# EAGLE schematic SNSP-CPU-01 (EAGLE 9.6.1)
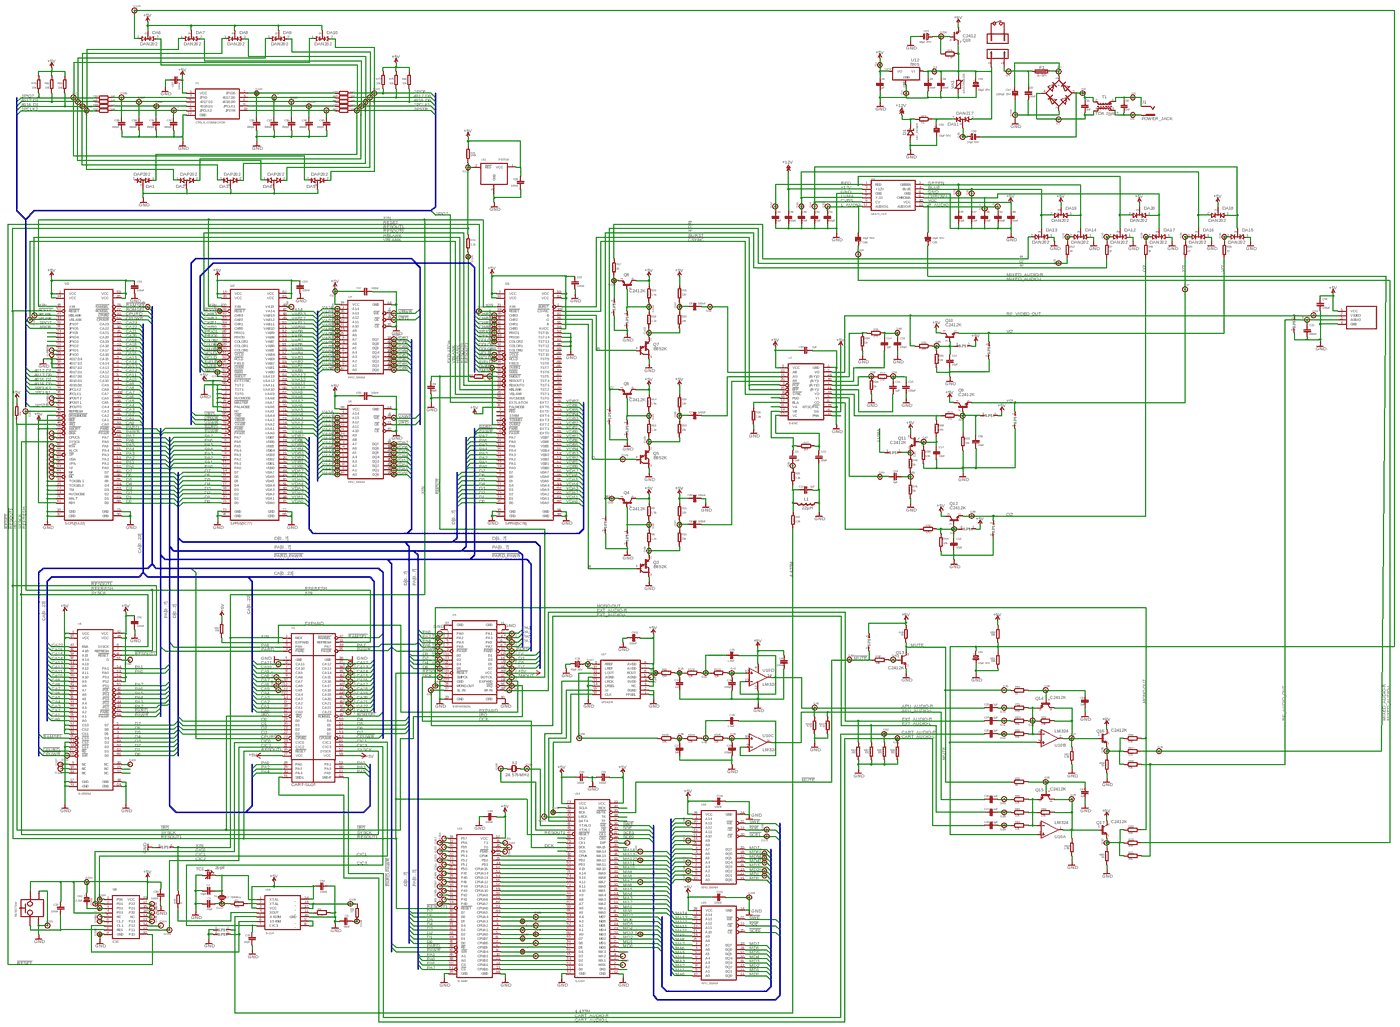
[diagram p0: schematic, sheet 1, overview]
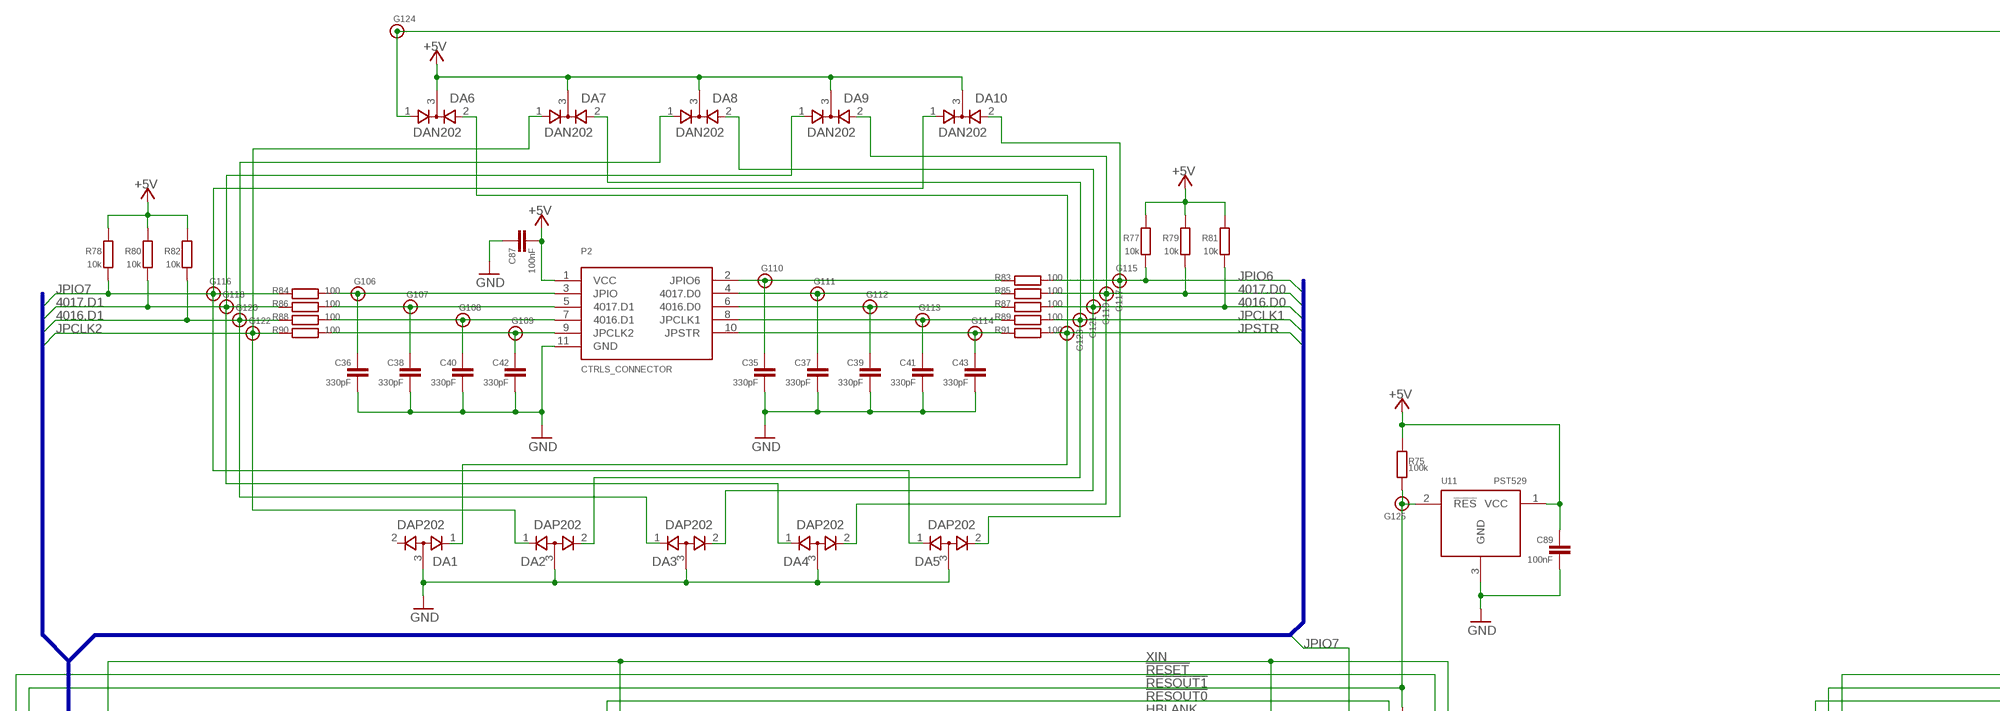
[diagram p1: schematic, sheet 1, part 1 of 4]
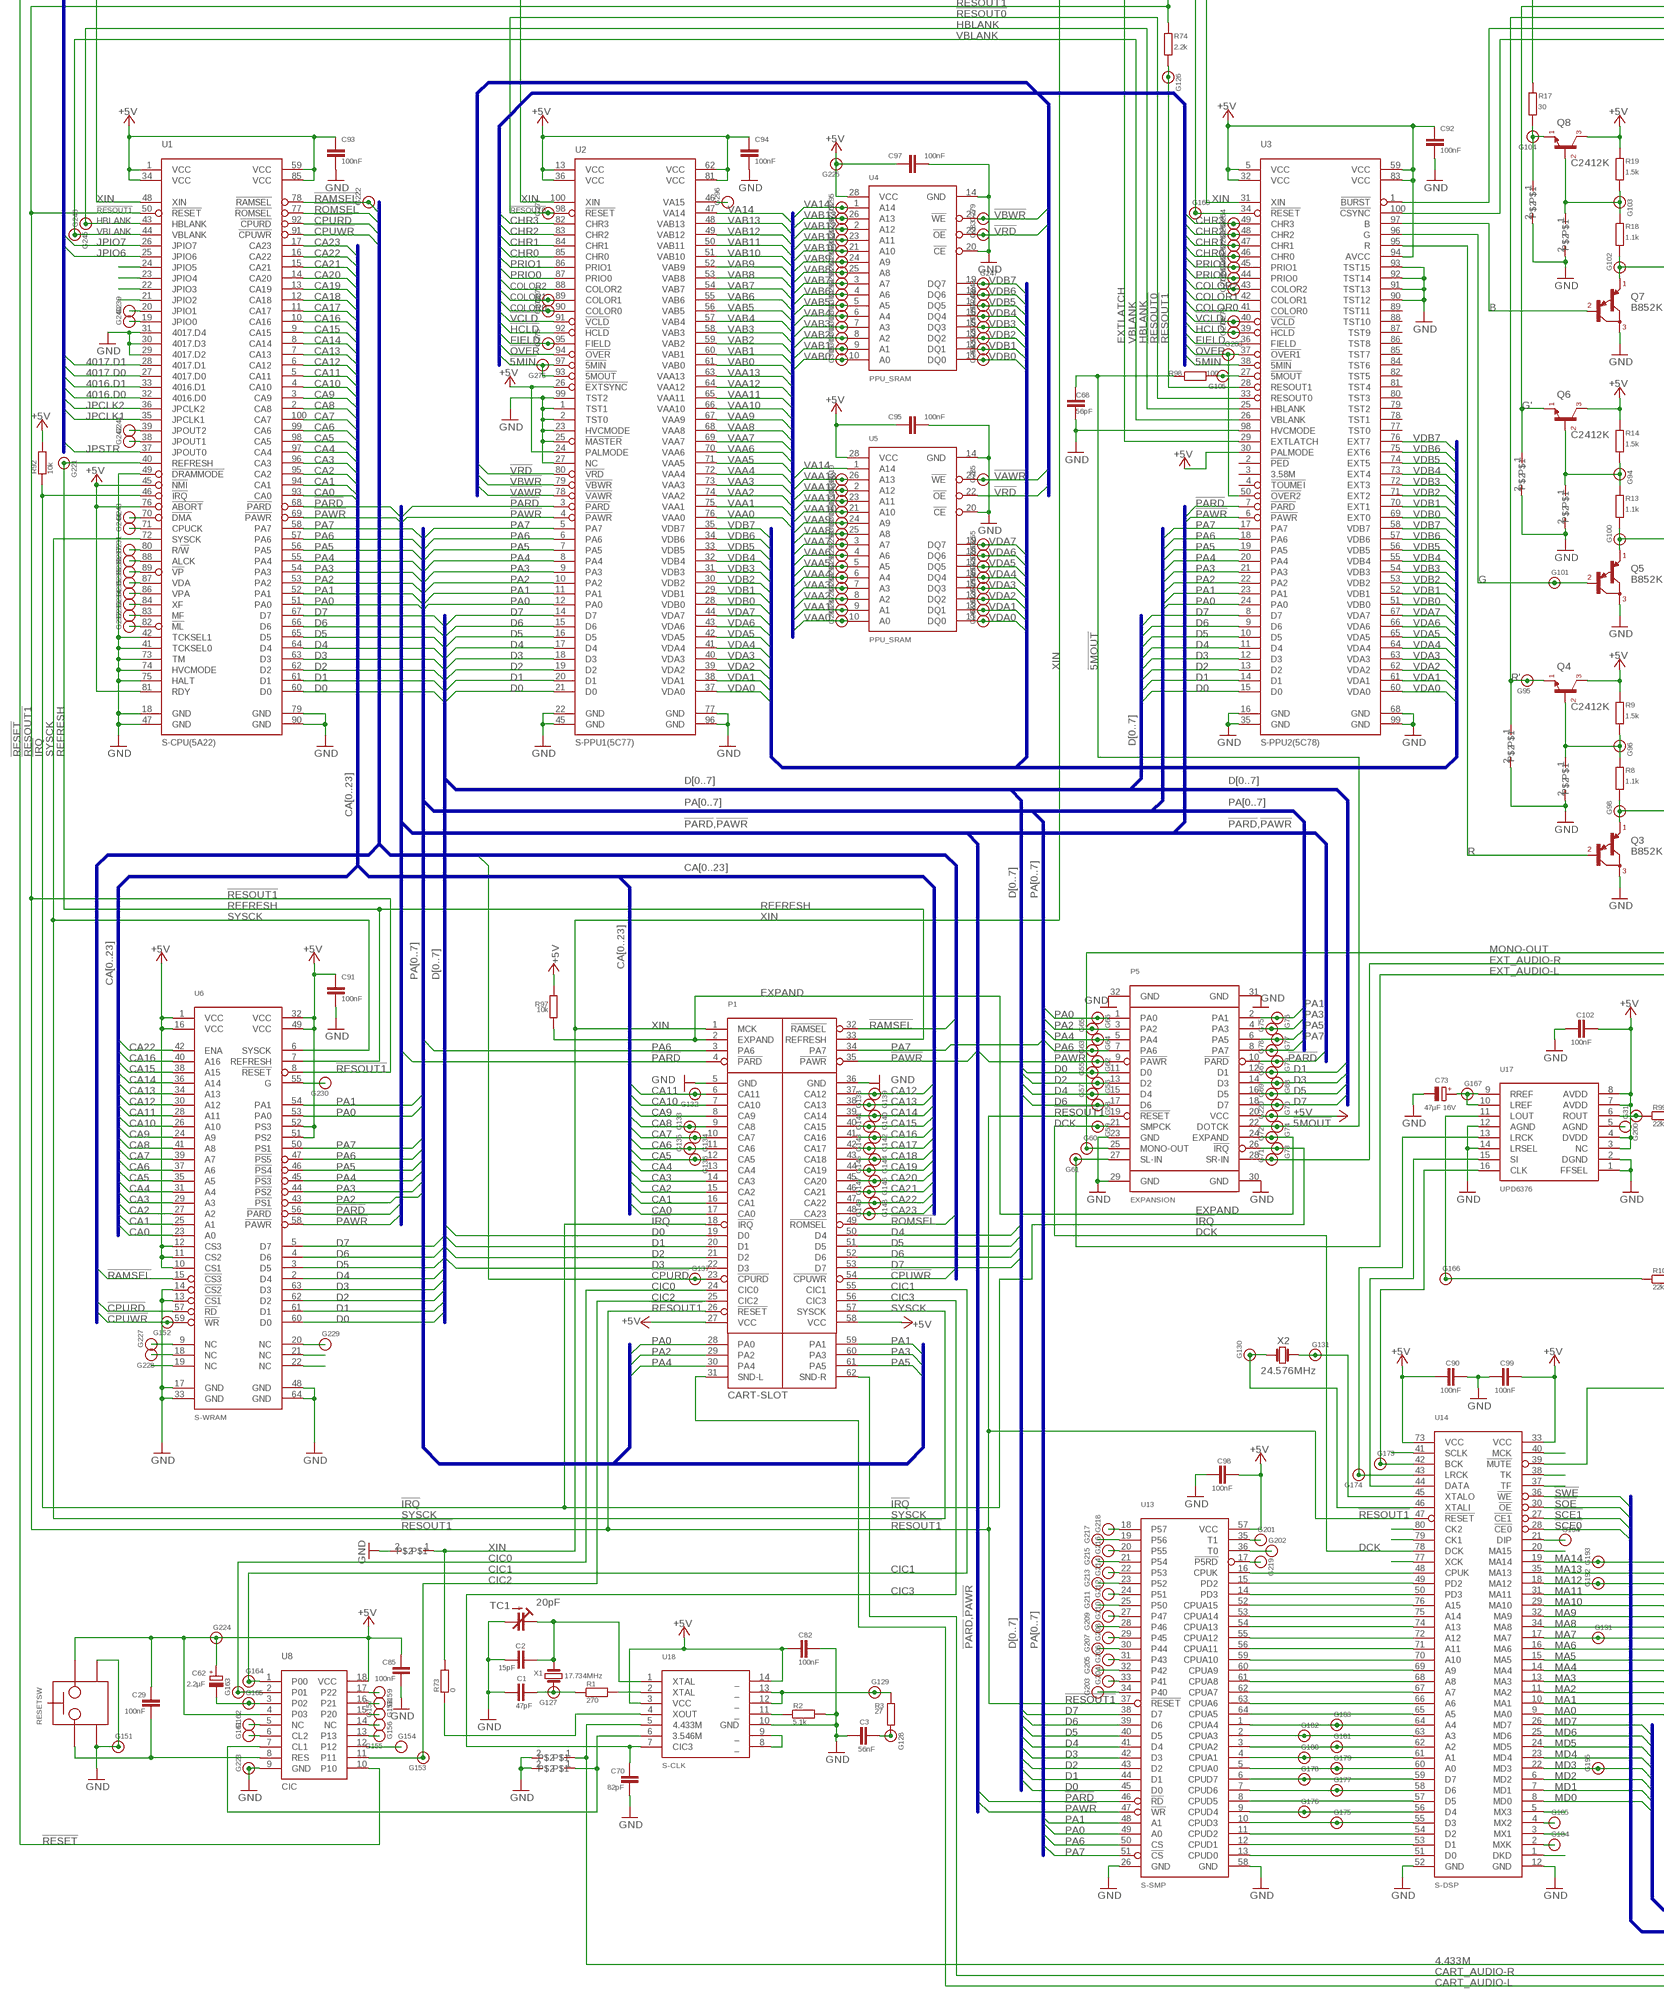
[diagram p2: schematic, sheet 1, part 2 of 4]
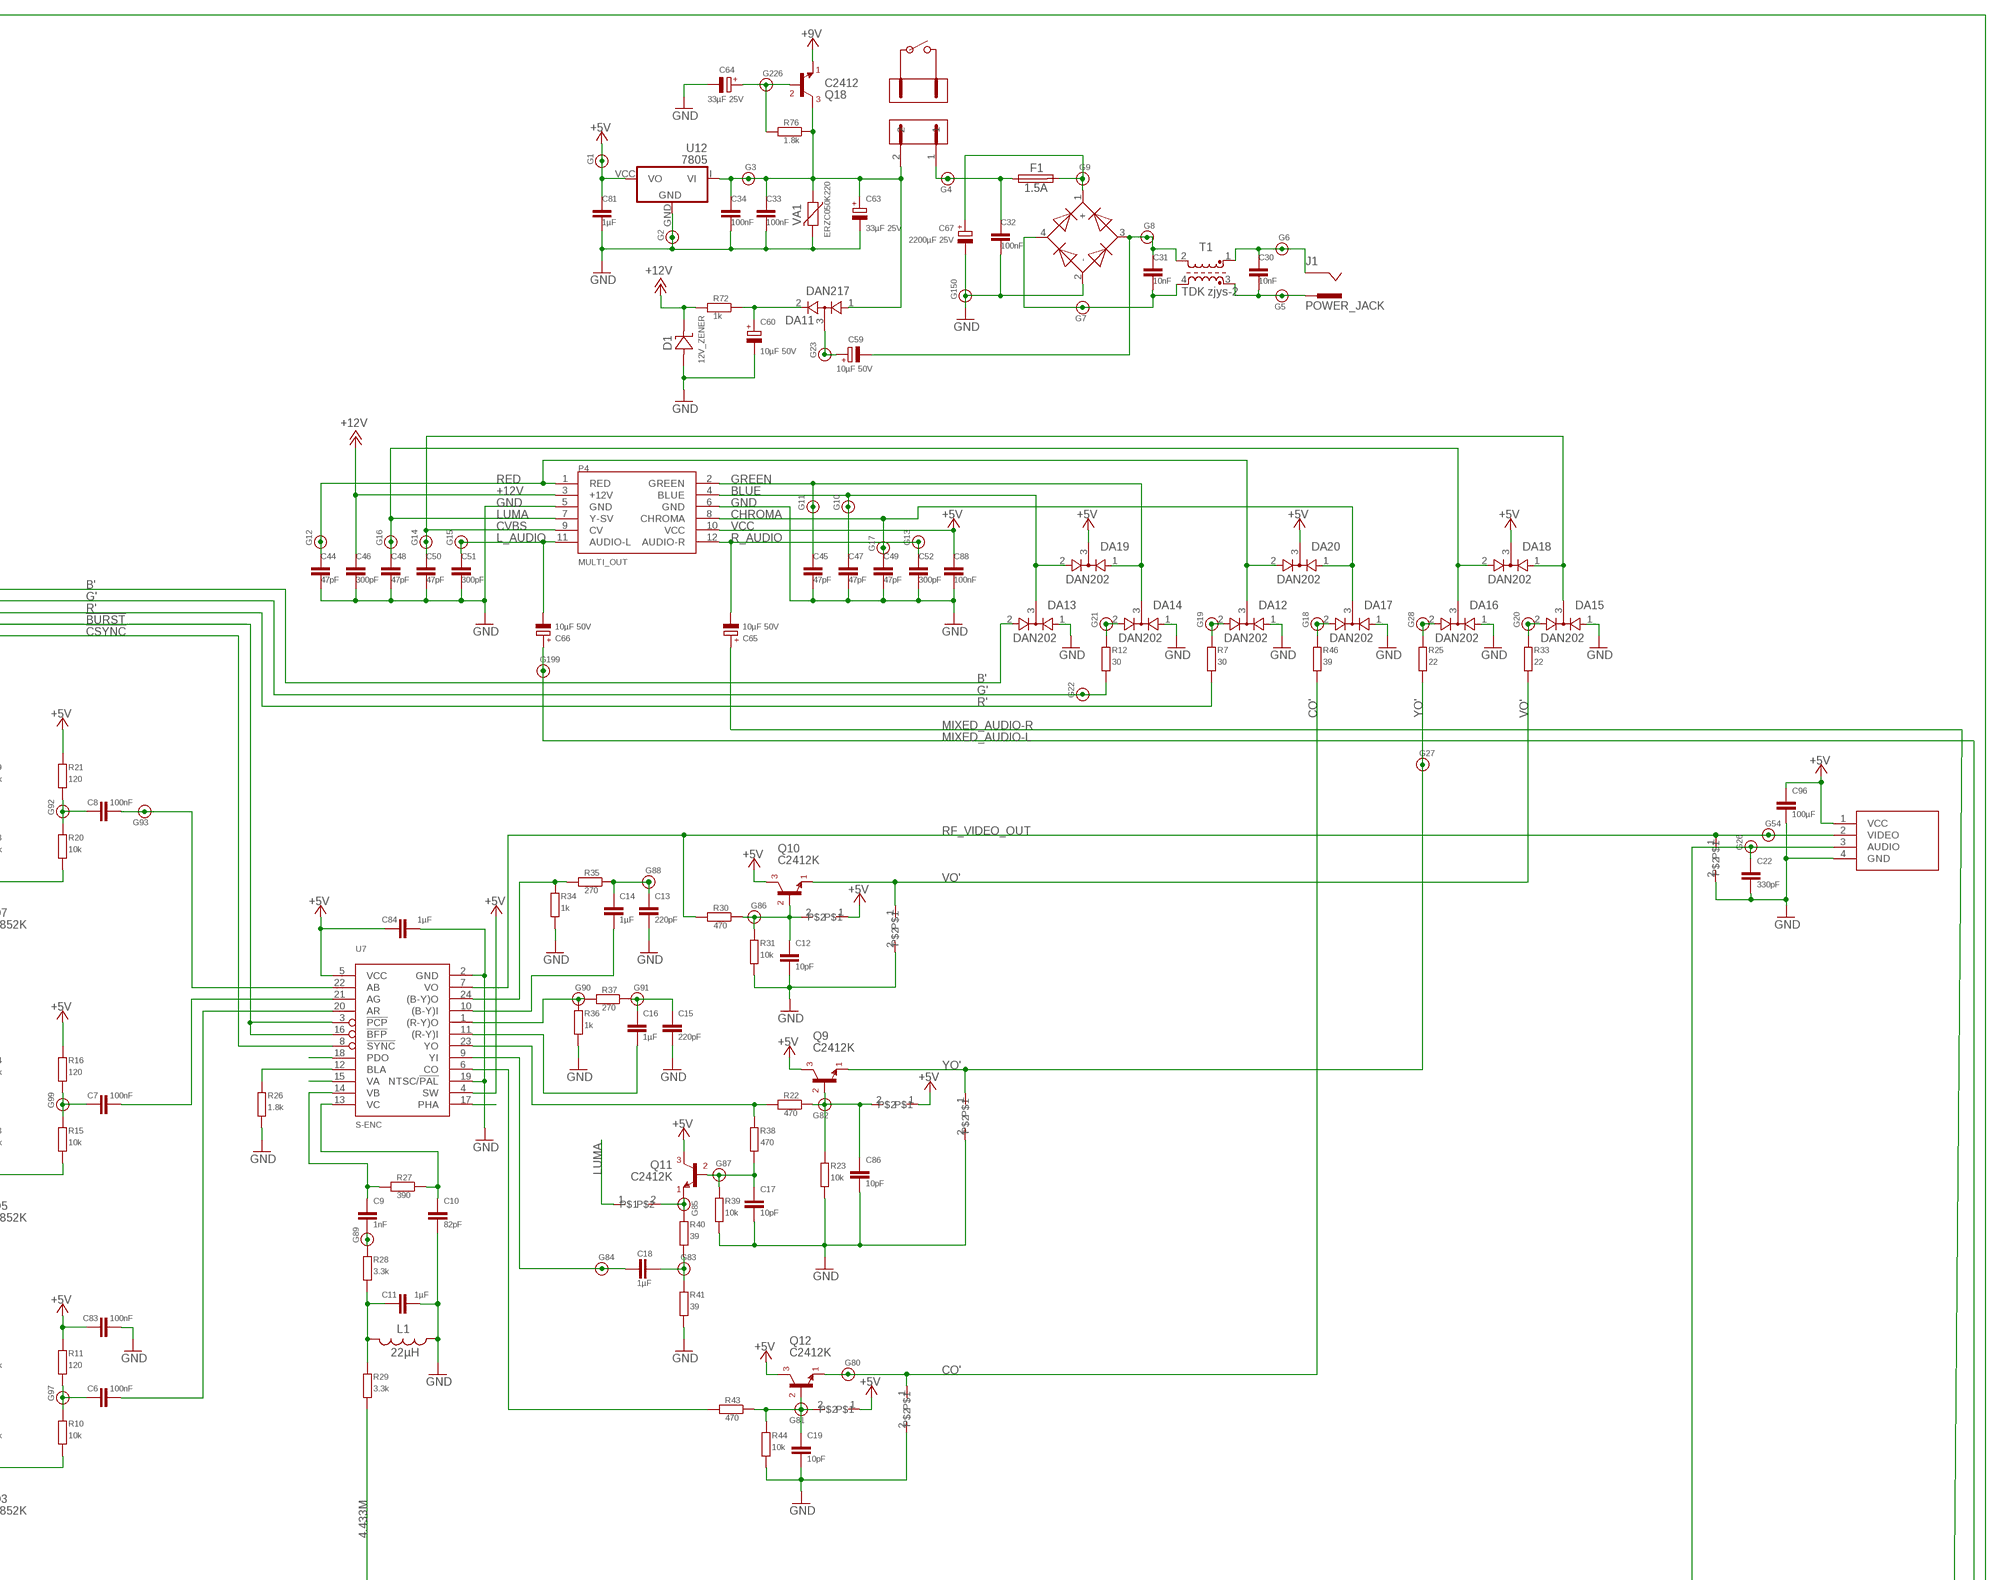
[diagram p3: schematic, sheet 1, part 3 of 4]
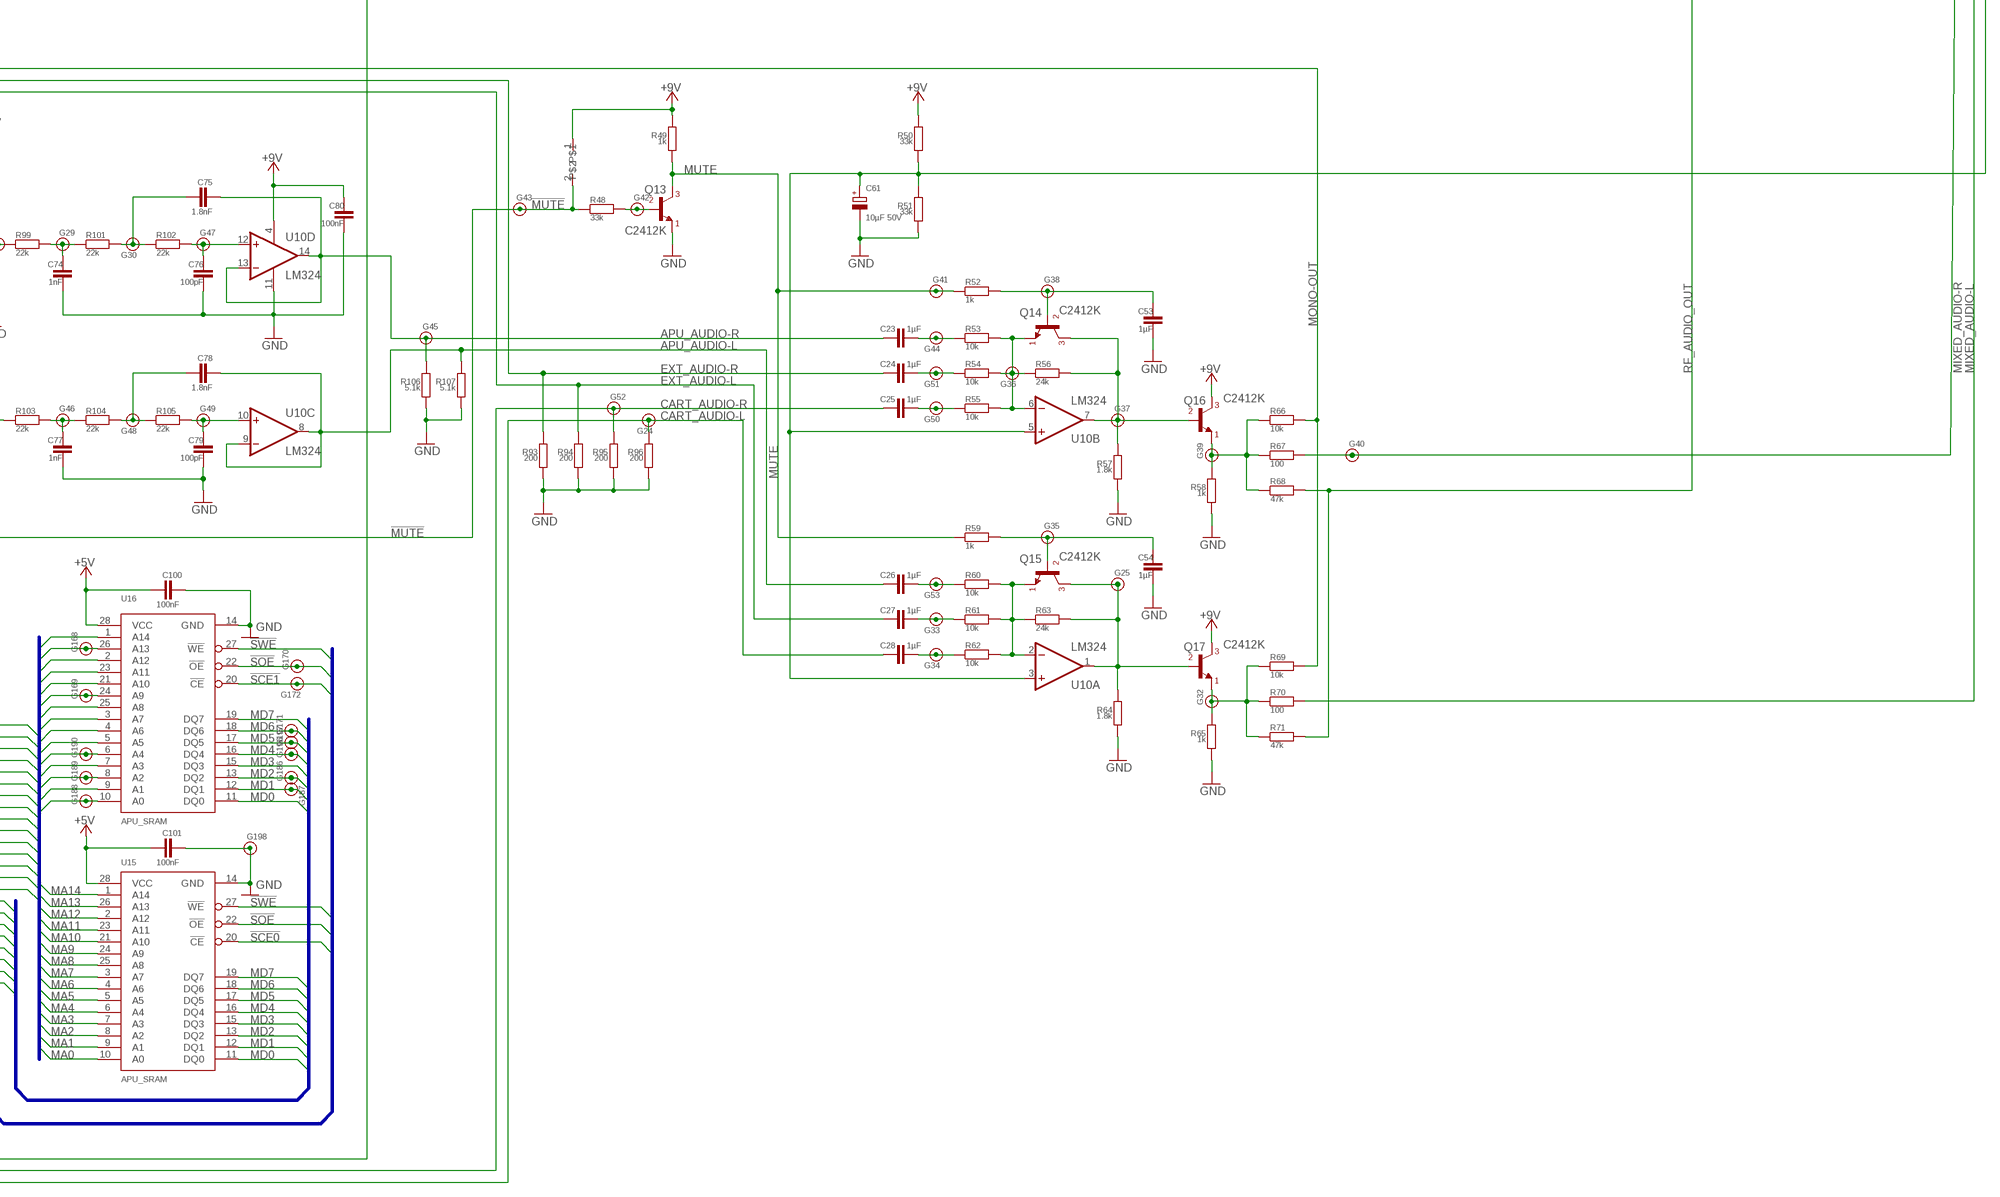
[diagram p4: schematic, sheet 1, part 4 of 4]

## Parts
C1  47pF  C0805  [0805]
C2  15pF  C0805  [0805]
C3  56nF  C0805  [0805]
C4  EMPTY_0805  [0805_EMPTY]
C5  EMPTY_0805  [0805_EMPTY]
C6  100nF  C0805  [0805]
C7  100nF  C0805  [0805]
C8  100nF  C0805  [0805]
C9  1nF  C0805  [0805]
C10  82pF  C0805  [0805]
C11  1µF  C0805  [0805]
C12  10pF  C0805  [0805]
C13  220pF  C0805  [0805]
C14  1µF  C0805  [0805]
C15  220pF  C0805  [0805]
C16  1µF  C0805  [0805]
C17  10pF  C0805  [0805]
C18  1µF  C0805  [0805]
C19  10pF  C0805  [0805]
C22  330pF  C0805  [0805]
C23  1µF  C0805  [0805]
C24  1µF  C0805  [0805]
C25  1µF  C0805  [0805]
C26  1µF  C0805  [0805]
C27  1µF  C0805  [0805]
C28  1µF  C0805  [0805]
C29  100nF  C0805  [0805]
C30  10nF  C0805  [0805]
C31  10nF  C0805  [0805]
C32  100nF  C0805  [0805]
C33  100nF  C0805  [0805]
C34  100nF  C0805  [0805]
C35  330pF  C0805  [0805]
C36  330pF  C0805  [0805]
C37  330pF  C0805  [0805]
C38  330pF  C0805  [0805]
C39  330pF  C0805  [0805]
C40  330pF  C0805  [0805]
C41  330pF  C0805  [0805]
C42  330pF  C0805  [0805]
C43  330pF  C0805  [0805]
C44  47pF  C0805  [0805]
C45  47pF  C0805  [0805]
C46  300pF  C0805  [0805]
C47  47pF  C0805  [0805]
C48  47pF  C0805  [0805]
C49  47pF  C0805  [0805]
C50  47pF  C0805  [0805]
C51  300pF  C0805  [0805]
C52  300pF  C0805  [0805]
C53  1µF  C0805  [0805]
C54  1µF  C0805  [0805]
C59  10µF 50V  CAPA_POLSMD6.5  [CAPA_POL_SMD_6.5]
C60  10µF 50V  CAPA_POLSMD6.5  [CAPA_POL_SMD_6.5]
C61  10µF 50V  CAPA_POLSMD6.5  [CAPA_POL_SMD_6.5]
C62  2.2µF  CAPA_POLSMD4.3  [CAPA_POL_SMD_4.3]
C63  33µF 25V  CAPA_POLSMD6.5  [CAPA_POL_SMD_6.5]
C64  33µF 25V  CAPA_POLSMD6.5  [CAPA_POL_SMD_6.5]
C65  10µF 50V  CAPA_POLSMD6.5  [CAPA_POL_SMD_6.5]
C66  10µF 50V  CAPA_POLSMD6.5  [CAPA_POL_SMD_6.5]
C67  2200µF 25V  CAPA_POLD16  [CAPA_POL]
C68  56pF  C0805  [0805]
C69  EMPTY_0805  [0805_EMPTY]
C70  82pF  C0805  [0805]
C73  47µF 16V  CAPA_POLSMD6.5  [CAPA_POL_SMD_6.5]
C74  1nF  C0805  [0805]
C75  1.8nF  C0805  [0805]
C76  100pF  C0805  [0805]
C77  1nF  C0805  [0805]
C78  1.8nF  C0805  [0805]
C79  100pF  C0805  [0805]
C80  100nF  C0805  [0805]
C81  1µF  C0805  [0805]
C82  100nF  C0805  [0805]
C83  100nF  C0805  [0805]
C84  1µF  C0805  [0805]
C85  100nF  C0805  [0805]
C86  10pF  C0805  [0805]
C87  100nF  C0805  [0805]
C88  100nF  C0805  [0805]
C89  100nF  C0805  [0805]
C90  100nF  C0805  [0805]
C91  100nF  C0805  [0805]
C92  100nF  C0805  [0805]
C93  100nF  C0805  [0805]
C94  100nF  C0805  [0805]
C95  100nF  C0805  [0805]
C96  100µF  C0805  [0805]
C97  100nF  C0805  [0805]
C98  100nF  C0805  [0805]
C99  100nF  C0805  [0805]
C100  100nF  C0805  [0805]
C101  100nF  C0805  [0805]
C102  100nF  C0805  [0805]
D1  12V_ZENER  D-ZENER  [SOT23]
DA1  DAP202  D_ARRAY_P202  [SOT23]
DA2  DAP202  D_ARRAY_P202  [SOT23]
DA3  DAP202  D_ARRAY_P202  [SOT23]
DA4  DAP202  D_ARRAY_P202  [SOT23]
DA5  DAP202  D_ARRAY_P202  [SOT23]
DA6  DAN202  D_ARRAY_N202  [SOT23]
DA7  DAN202  D_ARRAY_N202  [SOT23]
DA8  DAN202  D_ARRAY_N202  [SOT23]
DA9  DAN202  D_ARRAY_N202  [SOT23]
DA10  DAN202  D_ARRAY_N202  [SOT23]
DA11  DAN217  D_ARRAY_N217  [SOT23]
DA12  DAN202  D_ARRAY_N202  [SOT23]
DA13  DAN202  D_ARRAY_N202  [SOT23]
DA14  DAN202  D_ARRAY_N202  [SOT23]
DA15  DAN202  D_ARRAY_N202  [SOT23]
DA16  DAN202  D_ARRAY_N202  [SOT23]
DA17  DAN202  D_ARRAY_N202  [SOT23]
DA18  DAN202  D_ARRAY_N202  [SOT23]
DA19  DAN202  D_ARRAY_N202  [SOT23]
DA20  DAN202  D_ARRAY_N202  [SOT23]
DB1  RECTIFIER  [RECTIFIER]
E1  EMPTY_0805  [0805_EMPTY]
E2  EMPTY_0805  [0805_EMPTY]
E3  EMPTY_0805  [0805_EMPTY]
F1  1.5A  FUSE  [FUSE]
G1  TEST  [TEST]
G2  TEST  [TEST]
G3  TEST  [TEST]
G4  TEST  [TEST]
G5  TEST  [TEST]
G6  TEST  [TEST]
G7  TEST  [TEST]
G8  TEST  [TEST]
G9  TEST  [TEST]
G10  TEST  [TEST]
G11  TEST  [TEST]
G12  TEST  [TEST]
G13  TEST  [TEST]
G14  TEST  [TEST]
G15  TEST  [TEST]
G16  TEST  [TEST]
G17  TEST  [TEST]
G18  TEST  [TEST]
G19  TEST  [TEST]
G20  TEST  [TEST]
G21  TEST  [TEST]
G22  TEST  [TEST]
G23  TEST  [TEST]
G24  TEST  [TEST]
G25  TEST  [TEST]
G26  TEST  [TEST]
G27  TEST  [TEST]
G28  TEST  [TEST]
G29  TEST  [TEST]
G30  TEST  [TEST]
G31  TEST  [TEST]
G32  TEST  [TEST]
G33  TEST  [TEST]
G34  TEST  [TEST]
G35  TEST  [TEST]
G36  TEST  [TEST]
G37  TEST  [TEST]
G38  TEST  [TEST]
G39  TEST  [TEST]
G40  TEST  [TEST]
G41  TEST  [TEST]
G42  TEST  [TEST]
G43  TEST  [TEST]
G44  TEST  [TEST]
G45  TEST  [TEST]
G46  TEST  [TEST]
G47  TEST  [TEST]
G48  TEST  [TEST]
G49  TEST  [TEST]
G50  TEST  [TEST]
G51  TEST  [TEST]
G52  TEST  [TEST]
G53  TEST  [TEST]
G54  TEST  [TEST]
G55  TEST  [TEST]
G56  TEST  [TEST]
G57  TEST  [TEST]
G58  TEST  [TEST]
G59  TEST  [TEST]
G60  TEST  [TEST]
G61  TEST  [TEST]
G62  TEST  [TEST]
G63  TEST  [TEST]
G64  TEST  [TEST]
G65  TEST  [TEST]
G66  TEST  [TEST]
G67  TEST  [TEST]
G68  TEST  [TEST]
G69  TEST  [TEST]
G70  TEST  [TEST]
G71  TEST  [TEST]
G72  TEST  [TEST]
G73  TEST  [TEST]
G74  TEST  [TEST]
G75  TEST  [TEST]
G76  TEST  [TEST]
G77  TEST  [TEST]
G78  TEST  [TEST]
G79  TEST  [TEST]
G80  TEST  [TEST]
G81  TEST  [TEST]
G82  TEST  [TEST]
G83  TEST  [TEST]
G84  TEST  [TEST]
G85  TEST  [TEST]
G86  TEST  [TEST]
G87  TEST  [TEST]
G88  TEST  [TEST]
G89  TEST  [TEST]
G90  TEST  [TEST]
G91  TEST  [TEST]
G92  TEST  [TEST]
G93  TEST  [TEST]
G94  TEST  [TEST]
G95  TEST  [TEST]
G96  TEST  [TEST]
G97  TEST  [TEST]
G98  TEST  [TEST]
G99  TEST  [TEST]
G100  TEST  [TEST]
G101  TEST  [TEST]
G102  TEST  [TEST]
G103  TEST  [TEST]
G104  TEST  [TEST]
G105  TEST  [TEST]
G106  TEST  [TEST]
G107  TEST  [TEST]
G108  TEST  [TEST]
G109  TEST  [TEST]
G110  TEST  [TEST]
G111  TEST  [TEST]
G112  TEST  [TEST]
G113  TEST  [TEST]
G114  TEST  [TEST]
G115  TEST  [TEST]
G116  TEST  [TEST]
G117  TEST  [TEST]
G118  TEST  [TEST]
G119  TEST  [TEST]
G120  TEST  [TEST]
G121  TEST  [TEST]
G122  TEST  [TEST]
G123  TEST  [TEST]
G124  TEST  [TEST]
G125  TEST  [TEST]
G126  TEST  [TEST]
G127  TEST  [TEST]
G128  TEST  [TEST]
G129  TEST  [TEST]
G130  TEST  [TEST]
G131  TEST  [TEST]
G132  TEST  [TEST]
G133  TEST  [TEST]
G134  TEST  [TEST]
G135  TEST  [TEST]
G136  TEST  [TEST]
G137  TEST  [TEST]
G138  TEST  [TEST]
G139  TEST  [TEST]
G140  TEST  [TEST]
G141  TEST  [TEST]
G142  TEST  [TEST]
G143  TEST  [TEST]
G144  TEST  [TEST]
G145  TEST  [TEST]
G146  TEST  [TEST]
G147  TEST  [TEST]
G148  TEST  [TEST]
G149  TEST  [TEST]
G150  TEST  [TEST]
G151  TEST  [TEST]
G152  TEST  [TEST]
G153  TEST  [TEST]
G154  TEST  [TEST]
G155  TEST  [TEST]
G156  TEST  [TEST]
G157  TEST  [TEST]
G158  TEST  [TEST]
G159  TEST  [TEST]
G160  TEST  [TEST]
G161  TEST  [TEST]
G162  TEST  [TEST]
G163  TEST  [TEST]
G164  TEST  [TEST]
G165  TEST  [TEST]
G166  TEST  [TEST]
G167  TEST  [TEST]
G168  TEST  [TEST]
G169  TEST  [TEST]
G170  TEST  [TEST]
G171  TEST  [TEST]
G172  TEST  [TEST]
G173  TEST  [TEST]
G174  TEST  [TEST]
G175  TEST  [TEST]
G176  TEST  [TEST]
G177  TEST  [TEST]
G178  TEST  [TEST]
G179  TEST  [TEST]
G180  TEST  [TEST]
G181  TEST  [TEST]
G182  TEST  [TEST]
G183  TEST  [TEST]
G184  TEST  [TEST]
G185  TEST  [TEST]
G186  TEST  [TEST]
G187  TEST  [TEST]
G188  TEST  [TEST]
G189  TEST  [TEST]
G190  TEST  [TEST]
G191  TEST  [TEST]
G192  TEST  [TEST]
G193  TEST  [TEST]
G194  TEST  [TEST]
G195  TEST  [TEST]
G196  TEST  [TEST]
G197  TEST  [TEST]
G198  TEST  [TEST]
G199  TEST  [TEST]
G200  TEST  [TEST]
G201  TEST  [TEST]
G202  TEST  [TEST]
G203  TEST  [TEST]
G204  TEST  [TEST]
G205  TEST  [TEST]
G206  TEST  [TEST]
G207  TEST  [TEST]
G208  TEST  [TEST]
G209  TEST  [TEST]
G210  TEST  [TEST]
G211  TEST  [TEST]
G212  TEST  [TEST]
G213  TEST  [TEST]
G214  TEST  [TEST]
G215  TEST  [TEST]
G216  TEST  [TEST]
G217  TEST  [TEST]
G218  TEST  [TEST]
G219  TEST  [TEST]
G220  TEST  [TEST]
G221  TEST  [TEST]
G222  TEST  [TEST]
G223  TEST  [TEST]
G224  TEST  [TEST]
G225  TEST  [TEST]
G226  TEST  [TEST]
G227  TEST  [TEST]
G228  TEST  [TEST]
G229  TEST  [TEST]
G230  TEST  [TEST]
G231  TEST  [TEST]
G232  TEST  [TEST]
G233  TEST  [TEST]
G234  TEST  [TEST]
G235  TEST  [TEST]
G236  TEST  [TEST]
G237  TEST  [TEST]
G238  TEST  [TEST]
G239  TEST  [TEST]
G240  TEST  [TEST]
G241  TEST  [TEST]
G242  TEST  [TEST]
G243  TEST  [TEST]
G244  TEST  [TEST]
G245  TEST  [TEST]
G246  TEST  [TEST]
G247  TEST  [TEST]
G248  TEST  [TEST]
G249  TEST  [TEST]
G250  TEST  [TEST]
G251  TEST  [TEST]
G252  TEST  [TEST]
G253  TEST  [TEST]
G254  TEST  [TEST]
G255  TEST  [TEST]
G256  TEST  [TEST]
G257  TEST  [TEST]
G258  TEST  [TEST]
G259  TEST  [TEST]
G260  TEST  [TEST]
G261  TEST  [TEST]
G262  TEST  [TEST]
G263  TEST  [TEST]
G264  TEST  [TEST]
G265  TEST  [TEST]
G266  TEST  [TEST]
G267  TEST  [TEST]
G268  TEST  [TEST]
G269  TEST  [TEST]
G270  TEST  [TEST]
G271  TEST  [TEST]
G272  TEST  [TEST]
G273  TEST  [TEST]
G274  TEST  [TEST]
G275  TEST  [TEST]
G276  TEST  [TEST]
G277  TEST  [TEST]
G278  TEST  [TEST]
G279  TEST  [TEST]
G280  TEST  [TEST]
G281  TEST  [TEST]
G282  TEST  [TEST]
G283  TEST  [TEST]
G284  TEST  [TEST]
G285  TEST  [TEST]
G286  TEST  [TEST]
G287  TEST  [TEST]
G288  TEST  [TEST]
G289  TEST  [TEST]
G290  TEST  [TEST]
G291  TEST  [TEST]
G292  TEST  [TEST]
G293  TEST  [TEST]
G294  TEST  [TEST]
G295  TEST  [TEST]
G296  TEST  [TEST]
G297  TEST  [TEST]
G298  TEST  [TEST]
G299  TEST  [TEST]
G300  TEST  [TEST]
G301  TEST  [TEST]
G302  TEST  [TEST]
G303  TEST  [TEST]
G304  TEST  [TEST]
G305  TEST  [TEST]
G306  TEST  [TEST]
G307  TEST  [TEST]
G308  TEST  [TEST]
G309  TEST  [TEST]
G310  TEST  [TEST]
J1  POWER_JACK  [POWER_JACK]
J2  RF_MODULATOR  [RF]
L1  22µH  INDUCTOR  [INDUCTOR]
P1  CART-SLOT  [CART-SLOT]
P2  CTRLS_CONNECTOR  [CTRLS_CONNECTOR]
P3  PWR_SW  [PWR_SW]
P4  MULTI_OUT  [MULTI_OUT]
P5  EXPANSION  [EXPANSION]
Q3  B852K  PNP-DAR  [SOT23]
Q4  C2412K  NPN  [SOT23]
Q5  B852K  PNP-DAR  [SOT23]
Q6  C2412K  NPN  [SOT23]
Q7  B852K  PNP-DAR  [SOT23]
Q8  C2412K  NPN  [SOT23]
Q9  C2412K  NPN  [SOT23]
Q10  C2412K  NPN  [SOT23]
Q11  C2412K  NPN  [SOT23]
Q12  C2412K  NPN  [SOT23]
Q13  C2412K  NPN  [SOT23]
Q14  C2412K  NPN  [SOT23]
Q15  C2412K  NPN  [SOT23]
Q16  C2412K  NPN  [SOT23]
Q17  C2412K  NPN  [SOT23]
Q18  C2412  NPN  [SOT23]
R1  270  R0805  [0805]
R2  5.1k  R0805  [0805]
R3  27  R0805  [0805]
R4  EMPTY_0805  [0805_EMPTY]
R5  EMPTY_0805  [0805_EMPTY]
R6  EMPTY_0805  [0805_EMPTY]
R7  30  R0805  [0805]
R8  1.1k  R0805  [0805]
R9  1.5k  R0805  [0805]
R10  10k  R0805  [0805]
R11  120  R0805  [0805]
R12  30  R0805  [0805]
R13  1.1k  R0805  [0805]
R14  1.5k  R0805  [0805]
R15  10k  R0805  [0805]
R16  120  R0805  [0805]
R17  30  R0805  [0805]
R18  1.1k  R0805  [0805]
R19  1.5k  R0805  [0805]
R20  10k  R0805  [0805]
R21  120  R0805  [0805]
R22  470  R0805  [0805]
R23  10k  R0805  [0805]
R24  EMPTY_0805  [0805_EMPTY]
R25  22  R0805  [0805]
R26  1.8k  R0805  [0805]
R27  390  R0805  [0805]
R28  3.3k  R0805  [0805]
R29  3.3k  R0805  [0805]
R30  470  R0805  [0805]
R31  10k  R0805  [0805]
R32  EMPTY_0805  [0805_EMPTY]
R33  22  R0805  [0805]
R34  1k  R0805  [0805]
R35  270  R0805  [0805]
R36  1k  R0805  [0805]
R37  270  R0805  [0805]
R38  470  R0805  [0805]
R39  10k  R0805  [0805]
R40  39  R0805  [0805]
R41  39  R0805  [0805]
R42  EMPTY_0805  [0805_EMPTY]
R43  470  R0805  [0805]
R44  10k  R0805  [0805]
R45  EMPTY_0805  [0805_EMPTY]
R46  39  R0805  [0805]
R47  EMPTY_0805  [0805_EMPTY]
R48  33k  R0805  [0805]
R49  1k  R0805  [0805]
R50  33k  R0805  [0805]
R51  33k  R0805  [0805]
R52  1k  R0805  [0805]
R53  10k  R0805  [0805]
R54  10k  R0805  [0805]
R55  10k  R0805  [0805]
R56  24k  R0805  [0805]
R57  1.8k  R0805  [0805]
R58  1k  R0805  [0805]
R59  1k  R0805  [0805]
R60  10k  R0805  [0805]
R61  10k  R0805  [0805]
R62  10k  R0805  [0805]
R63  24k  R0805  [0805]
R64  1.8k  R0805  [0805]
R65  1k  R0805  [0805]
R66  10k  R0805  [0805]
R67  100  R0805  [0805]
R68  47k  R0805  [0805]
R69  10k  R0805  [0805]
R70  100  R0805  [0805]
R71  47k  R0805  [0805]
R72  1k  R0805  [0805]
R73  0  R0805  [0805]
R74  2.2k  R0805  [0805]
R75  100k  R0805  [0805]
R76  1.8k  R0805  [0805]
R77  10k  R0805  [0805]
R78  10k  R0805  [0805]
R79  10k  R0805  [0805]
R80  10k  R0805  [0805]
R81  10k  R0805  [0805]
R82  10k  R0805  [0805]
R83  100  R0805  [0805]
R84  100  R0805  [0805]
R85  100  R0805  [0805]
R86  100  R0805  [0805]
R87  100  R0805  [0805]
R88  100  R0805  [0805]
R89  100  R0805  [0805]
R90  100  R0805  [0805]
R91  100  R0805  [0805]
R92  10k  R0805  [0805]
R93  200  R0805  [0805]
R94  200  R0805  [0805]
R95  200  R0805  [0805]
R96  200  R0805  [0805]
R97  10k  R0805  [0805]
R98  100  R0805  [0805]
R99  22k  R0805  [0805]
R101  22k  R0805  [0805]
R102  22k  R0805  [0805]
R103  22k  R0805  [0805]
R104  22k  R0805  [0805]
R105  22k  R0805  [0805]
R106  5.1k  R0805  [0805]
R107  5.1k  R0805  [0805]
R108  EMPTY_0805  [0805_EMPTY]
R109  EMPTY_0805  [0805_EMPTY]
R110  EMPTY_0805  [0805_EMPTY]
R111  EMPTY_0805  [0805_EMPTY]
RESETSW  RESET_SW  [RESET_SW]
T1  TDK zjys-2  TRANSF  [TRANSF]
TC1  20pF  C-TRIMM  [C-TRIMM]
U1  S-CPU(5A22)  [100QFP0.65]
U2  S-PPU1(5C77)  [100QFP0.65]
U3  S-PPU2(5C78)  [100QFP0.65]
U4  PPU_SRAM  [SO28L]
U5  PPU_SRAM  [SO28L]
U6  S-WRAM  [SSO64]
U7  S-ENC  [SO24]
U8  CIC  [CIC]
U10  LM324  [SO14]
U11  PST529  [PST529]
U12  7805  [TO220V]
U13  S-SMP  [64QFP1.00]
U14  S-DSP  [80QFP0.8]
U15  APU_SRAM  [SO28W]
U16  APU_SRAM  [SO28W]
U17  UPD6376  [SO16]
U18  S-CLK  [SO14L]
VA1  ERZC050K220  VARISTOR  [VARISTOR]
X1  17.734MHz  XTAL_MAIN  [XTAL_MAIN]
X2  24.576MHz  XTAL_S-DSP  [XTAL_S-DSP]

## Nets
4.433M: C69.1 R29.1 U18.5(4.433M)
4016.D0: DA3.2 DA8.2 G119.T R81.1 R87.2 U1.32(4016.D0)
4016.D1: DA3.1 DA8.1 G120.T R82.1 R88.1 U1.33(4016.D1)
4017.D0: DA4.2 DA9.2 G117.T R79.1 R85.2 U1.27(4017.D0)
4017.D1: DA4.1 DA9.1 G118.T R80.1 R86.1 U1.28(4017.D1)
!5MIN: G275.T U2.93(!5MOUT) U2.97(!5MIN) U3.38(!5MIN)
!5MOUT: C68.1 G74.T P5.22(DOTCK) R98.1
!BURST: U3.1(!BURST) U7.3(!PCP) U7.16(!BFP)
!CPURD: G137.T P1.23(!CPURD) U1.92(!CPURD) U6.57(!RD)
!CPUWR: G152.T P1.54(!CPUWR) U1.91(!CPUWR) U6.59(!WR)
!CSYNC: U3.100(!CSYNC) U7.8(!SYNC)
!HCLD: G274.T U2.92(!HCLD) U3.39(!HCLD)
!IRQ: G73.T P1.18(!IRQ) P5.26(!IRQ) R92.1 U1.46(!IRQ)
!MUTE: G43.T R47.2 R48.1 U14.39(!MUTE)
!OVER: G263.T U2.94(!OVER) U3.37(!OVER1) U3.50(!OVER2)
!PARD: G79.T P1.4(!PARD) P5.10(!PARD) U1.68(!PARD) U2.3(!PARD) U3.7(!PARD) U6.56(!PARD) U13.46(!RD)
!PAWR: G62.T P1.35(!PAWR) P5.9(!PAWR) U1.69(!PAWR) U2.4(!PAWR) U3.6(!PAWR) U6.58(!PAWR) U13.47(!WR)
!RAMSEL: G222.T P1.32(!RAMSEL) U1.78(!RAMSEL) U6.15(!CS3)
!RESET: G160.T U3.34(!RESET) U8.10
!RESOUT0: G277.T U2.98(!RESET) U3.33(RESOUT0)
!RESOUT1: G125.T P1.26(!RESET) P5.19(!RESET) R74.2 R75.1 U1.50(!RESET) U6.8(!RESET) U11.2(!RES) U13.37(!RESET) U14.47(!RESET)
!ROMSEL: P1.49(!ROMSEL) U1.77(!ROMSEL)
!SCE0: U14.28(!CE0) U15.20(!CE)
!SCE1: G172.T U14.27(!CE1) U16.20(!CE)
!SOE: G170.T U14.30(!OE) U15.22(!OE) U16.22(!OE)
!SWE: U14.36(!WE) U15.27(!WE) U16.27(!WE)
!VAWR: G285.T U2.78(!VAWR) U5.27(!WE)
!VBWR: G279.T U2.79(!VBWR) U4.27(!WE)
!VCLD: G273.T U2.91(!VCLD) U3.40(!VCLD)
!VRD: G283.T U2.80(!VRD) U4.22(!OE) U5.22(!OE)
+9V: C80.2 Q16.3 Q17.3 Q18.2 R47.1 R49.1 R50.1 U10.4(P:V+)
+12V: C46.2 D1.3 P4.3(+12V) R72.2
/RESOUT1: G126.T R74.1 U3.28(RESOUT1)
APU_AUDIO-L: C26.1 C78.2 R107.1 U10.8(C:OUT) U10.9(C:-IN)
APU_AUDIO-R: C23.1 C75.2 G45.T R106.1 U10.13(D:-IN) U10.14(D:OUT)
B: Q7.1 U3.97(B)
B': DA13.2 R17.2
BLUE: C47.2 DA13.3 DA19.2 G10.T P4.4(BLUE)
CA0: P1.17(CA0) U1.93(CA0) U6.23(A0)
CA1: P1.16(CA1) U1.94(CA1) U6.25(A1)
CA2: P1.15(CA2) U1.95(CA2) U6.27(A2)
CA3: P1.14(CA3) U1.96(CA3) U6.29(A3)
CA4: P1.13(CA4) U1.97(CA4) U6.31(A4)
CA5: G136.T P1.12(CA5) U1.98(CA5) U6.35(A5)
CA6: G135.T P1.11(CA6) U1.99(CA6) U6.37(A6)
CA7: G134.T P1.10(CA7) U1.100(CA7) U6.39(A7)
CA8: G133.T P1.9(CA8) U1.2(CA8) U6.41(A8)
CA9: P1.8(CA9) U1.3(CA9) U6.24(A9)
CA10: P1.7(CA10) U1.4(CA10) U6.26(A10)
CA11: G132.T P1.6(CA11) U1.5(CA11) U6.28(A11)
CA12: G139.T P1.37(CA12) U1.6(CA12) U6.30(A12)
CA13: G138.T P1.38(CA13) U1.7(CA13) U6.34(A13)
CA14: G140.T P1.39(CA14) U1.8(CA14) U6.36(A14)
CA15: G141.T P1.40(CA15) U1.9(CA15) U6.38(A15)
CA16: G142.T P1.41(CA16) U1.10(CA16) U6.40(A16)
CA17: G143.T P1.42(CA17) U1.11(CA17)
CA18: G144.T P1.43(CA18) U1.12(CA18)
CA19: G145.T P1.44(CA19) U1.13(CA19)
CA20: G146.T P1.45(CA20) U1.14(CA20)
CA21: G147.T P1.46(CA21) U1.15(CA21)
CA22: G148.T P1.47(CA22) U1.16(CA22) U6.42(ENA)
CA23: G149.T P1.48(CA23) U1.17(CA23)
CART_AUDIO-L: C28.1 G24.T P1.31(SND-L) R96.1
CART_AUDIO-R: C25.1 G52.T P1.62(SND-R) R95.1
CHR0: G267.T U2.85(CHR0) U3.46(CHR0)
CHR1: G266.T U2.84(CHR1) U3.47(CHR1)
CHR2: G265.T U2.83(CHR2) U3.48(CHR2)
CHR3: G264.T U2.82(CHR3) U3.49(CHR3)
CHROMA: C49.2 DA17.3 DA20.1 G17.T P4.8(CHROMA)
CIC0: G163.T P1.24(CIC0) U8.2(P01)
CIC1: G164.T P1.55(CIC1) U8.1(P00)
CIC2: G153.T P1.25(CIC2) U8.11
CIC3: C70.1 P1.56(CIC3) U18.7(CIC3)
CO': G80.T Q12.2 R45.1 R46.1
COLOR0: G272.T U2.90(COLOR0) U3.41(COLOR0)
COLOR1: G271.T U2.89(COLOR1) U3.42(COLOR1)
COLOR2: G270.T U2.88(COLOR2) U3.43(COLOR2)
CVBS: C50.2 DA15.3 DA18.1 G14.T P4.9(CV)
D0: G55.T P1.19(D0) P5.11(D0) U1.60(D0) U2.21(D0) U3.15(D0) U6.60(D0) U13.45(D0)
D1: G67.T P1.20(D1) P5.12(D1) U1.61(D1) U2.20(D1) U3.14(D1) U6.61(D1) U13.44(D1)
D2: G56.T P1.21(D2) P5.13(D2) U1.62(D2) U2.19(D2) U3.13(D2) U6.62(D2) U13.43(D2)
D3: G68.T P1.22(D3) P5.14(D3) U1.63(D3) U2.18(D3) U3.12(D3) U6.63(D3) U13.42(D3)
D4: G57.T P1.50(D4) P5.15(D4) U1.64(D4) U2.17(D4) U3.11(D4) U6.2(D4) U13.41(D4)
D5: G69.T P1.51(D5) P5.16(D5) U1.65(D5) U2.16(D5) U3.10(D5) U6.3(D5) U13.40(D5)
D6: G58.T P1.52(D6) P5.17(D6) U1.66(D6) U2.15(D6) U3.9(D6) U6.4(D6) U13.39(D6)
D7: G70.T P1.53(D7) P5.18(D7) U1.67(D7) U2.14(D7) U3.8(D7) U6.5(D7) U13.38(D7)
DCK: G59.T P5.21(SMPCK) U14.78(DCK)
EXPAND: G72.T P1.2(EXPAND) P5.24(EXPAND) R97.1
EXT_AUDIO-L: C27.1 G61.T P5.27(SL-IN) R94.1
EXT_AUDIO-R: C24.1 G71.T P5.28(SR-IN) R93.1
FIELD: G276.T U2.95(FIELD) U3.36(FIELD)
G: G101.T Q5.1 U3.96(G)
G': G22.T Q6.2 R5.1 R12.1
GND: C1.2 C2.2 C3.1 C4.2 C5.2 C10.2 C11.2 C12.2 C13.1 C15.1 C17.2 C19.2 C22.2 C32.1 C33.1 C34.1 C35.2 C36.2 C37.2 C38.2 C39.2 C40.2 C41.2 C42.2 C43.2 C44.1 C45.1 C46.1 C47.1 C48.1 C49.1 C50.1 C51.1 C52.1 C53.1 C54.1 C60.- C61.- C63.- C64.- C67.- C68.2 C69.2 C70.2 C73.- C74.1 C76.1 C77.1 C79.1 C80.1 C81.1 C82.2 C83.2 C84.2 C85.2 C86.2 C87.1 C88.1 C89.2 C90.2 C91.2 C92.2 C93.2 C94.2 C95.2 C96.2 C97.2 C98.1 C99.1 C100.2 C101.2 C102.1 D1.1 DA1.3 DA2.3 DA3.3 DA4.3 DA5.3 DA12.1 DA13.1 DA14.1 DA15.1 DA16.1 DA17.1 DB1.2(-) E1.2 E2.2 E3.2 G2.T G150.T G151.T G198.T G223.T J2.4(GND) L1.1 P1.5(GND) P1.36(GND) P2.11(GND) P4.5(GND) P4.6(GND) P5.23(GND) P5.29(GND) P5.30(GND) P5.31(GND) P5.32(GND) Q3.3 Q5.3 Q7.3 Q13.2 R2.2 R4.2 R5.2 R6.2 R23.1 R24.2 R26.1 R31.1 R32.2 R34.1 R36.1 R39.1 R41.1 R44.1 R45.2 R51.2 R57.2 R58.2 R64.2 R65.2 R93.2 R94.2 R95.2 R96.2 R106.2 R107.2 R111.2 RESETSW.3(GND) RESETSW.4(GND) TC1.- U1.18(GND) U1.29(4017.D2) U1.30(4017.D3) U1.31(4017.D4) U1.41(TCKSEL0) U1.42(TCKSEL1) U1.47(GND) U1.49(!DRAMMODE) U1.73(TM) U1.74(HVCMODE) U1.75(HALT) U1.79(GND) U1.90(GND) U2.1(TST1) U2.2(TST0) U2.22(GND) U2.23(HVCMODE) U2.25(!MASTER) U2.27(NC) U2.45(GND) U2.77(GND) U2.96(GND) U2.99(TST2) U3.16(GND) U3.35(GND) U3.68(GND) U3.90(TST12) U3.91(TST13) U3.92(TST14) U3.93(TST15) U3.98(HVCMODE) U3.99(GND) U4.14(GND) U4.20(!CE) U5.14(GND) U5.20(!CE) U6.13(!CS1) U6.14(!CS2) U6.17(GND) U6.33(GND) U6.48(GND) U6.64(GND) U7.2(GND) U7.19(NTSC/!PAL) U8.9(GND) U10.11(P:V-) U11.3(GND) U12.GND U13.26(GND) U13.58(GND) U14.12(GND) U14.52(GND) U15.14(GND) U16.14(GND) U17.1(FFSEL) U17.2(DGND) U17.12(AGND) U17.14(LRSEL) U18.10(GND) VA1.2
GREEN: C45.2 DA14.3 DA19.1 G11.T P4.2(GREEN)
HBLANK: G246.T U1.43(HBLANK) U3.25(HBLANK)
JPCLK1: DA2.2 DA7.2 G121.T R89.2 U1.35(JPCLK1)
JPCLK2: DA2.1 DA7.1 G122.T R90.1 U1.36(JPCLK2)
JPIO6: DA5.2 DA10.2 G115.T R77.1 R83.2 U1.25(JPIO6)
JPIO7: DA5.1 DA10.1 G116.T R78.1 R84.1 U1.26(JPIO7) U3.29(EXTLATCH)
JPSTR: DA1.1 DA6.2 G123.T R91.2 U1.37(JPOUT0)
L_AUDIO: C51.2 C66.- G15.T P4.11(AUDIO-L)
LUMA: C48.2 DA16.3 DA18.2 G16.T P4.7(Y-SV) R42.1
MA0: G188.T U14.9(MA0) U15.10(A0) U16.10(A0)
MA1: U14.10(MA1) U15.9(A1) U16.9(A1)
MA2: G189.T U14.11(MA2) U15.8(A2) U16.8(A2)
MA3: U14.13(MA3) U15.7(A3) U16.7(A3)
MA4: G190.T U14.14(MA4) U15.6(A4) U16.6(A4)
MA5: U14.15(MA5) U15.5(A5) U16.5(A5)
MA6: U14.16(MA6) U15.4(A6) U16.4(A6)
MA7: G191.T U14.17(MA7) U15.3(A7) U16.3(A7)
MA8: U14.34(MA8) U15.25(A8) U16.25(A8)
MA9: G169.T U14.32(MA9) U15.24(A9) U16.24(A9)
MA10: U14.29(MA10) U15.21(A10) U16.21(A10)
MA11: U14.31(MA11) U15.23(A11) U16.23(A11)
MA12: G192.T U14.18(MA12) U15.2(A12) U16.2(A12)
MA13: G168.T U14.35(MA13) U15.26(A13) U16.26(A13)
MA14: G193.T U14.19(MA14) U15.1(A14) U16.1(A14)
MA15: U14.20(MA15)
MD0: U14.8(MD0) U15.11(DQ0) U16.11(DQ0)
MD1: G187.T U14.7(MD1) U15.12(DQ1) U16.12(DQ1)
MD2: G186.T U14.6(MD2) U15.13(DQ2) U16.13(DQ2)
MD3: G195.T U14.22(MD3) U15.15(DQ3) U16.15(DQ3)
MD4: G196.T U14.23(MD4) U15.16(DQ4) U16.16(DQ4)
MD5: G197.T U14.24(MD5) U15.17(DQ5) U16.17(DQ5)
MD6: G171.T U14.25(MD6) U15.18(DQ6) U16.18(DQ6)
MD7: U14.26(MD7) U15.19(DQ7) U16.19(DQ7)
MIXED_AUDIO-L: C66.+ G199.T R70.2
MIXED_AUDIO-R: C65.+ G40.T R67.2
MONO-OUT: G60.T P5.25(MONO-OUT) R66.2 R69.2
MUTE: G41.T Q13.3 R49.2 R52.1 R59.1
N$1: C4.1 U8.7(CL1) U18.6(3.546M)
N$2: R1.2 U18.2(XTAL)
N$3: C62.- G165.T U8.3(P02)
N$4: C29.2 RESETSW.2 U8.8(RES)
N$5: R73.1 U18.4(XOUT)
N$6: C36.1 G106.T P2.3(JPIO) R84.2
N$7: C1.1 G127.T R1.1 X1.P$1
N$8: C38.1 G107.T P2.5(4017.D1) R86.2
N$9: R2.1 U18.11(_)
N$10: C2.1 TC1.+ U18.1(XTAL) X1.P$2
N$11: G129.T R3.1 U18.12(_) U18.13(_)
N$12: C40.1 G108.T P2.7(4016.D1) R88.2
N$13: U18.8(_) U18.9(_)
N$14: C42.1 G109.T P2.9(JPCLK2) R90.2
N$15: C35.1 G110.T P2.2(JPIO6) R83.1
N$16: C37.1 G111.T P2.4(4017.D0) R85.1
N$17: C39.1 G112.T P2.6(4016.D0) R87.1
N$18: C41.1 G113.T P2.8(JPCLK1) R89.1
N$19: C43.1 G114.T P2.10(JPSTR) R91.1
N$20: C61.+ DA6.1 G124.T R50.2 R51.1 U10.3(A:+IN) U10.5(B:+IN)
N$21: G105.T R98.2 U3.27(!5MOUT)
N$22: E1.1 G96.T Q4.1 R8.2 R9.1
N$23: C6.1 G97.T R10.2 R11.1
N$24: G98.T Q3.2 R8.1 R10.1
N$25: E2.1 G94.T Q6.1 R13.2 R14.1
N$26: C6.2 U7.20(AR)
N$27: C7.1 G99.T R15.2 R16.1
N$28: G100.T Q5.2 R13.1 R15.1
N$29: C7.2 U7.21(AG)
N$30: E3.1 G103.T Q8.1 R18.2 R19.1
N$31: C8.1 G92.T R20.2 R21.1
N$32: G102.T Q7.2 R18.1 R20.1
N$33: C8.2 G93.T U7.22(AB)
N$34: G104.T Q8.2 R6.1 R17.1
N$35: R26.2 U7.12(BLA)
N$36: R34.2 R35.2 U7.24((B-Y)O)
N$37: C13.2 C14.2 G88.T R35.1
N$38: G90.T R36.2 R37.2 U7.1((R-Y)O)
N$39: C15.2 C16.2 G91.T R37.1
N$40: C19.1 G81.T Q12.1 R43.1 R44.2 R110.2
N$41: C18.1 G83.T R40.1 R41.2
N$42: C14.1 U7.10((B-Y)I)
N$43: C16.1 U7.11((R-Y)I)
N$44: G85.T Q11.2 R40.2 R42.2
N$45: C17.1 G87.T Q11.1 R38.1 R39.2
N$46: R22.2 R38.2 U7.23(YO)
N$47: C86.1 G82.T Q9.1 R22.1 R23.2 R108.2
N$48: DA14.2 G21.T R12.2
N$49: C18.2 G84.T U7.9(YI)
N$50: C12.1 G86.T Q10.1 R30.1 R31.2 R109.2
N$51: DA12.2 G19.T R7.2
N$52: DA17.2 G18.T R46.2
N$53: R43.2 U7.6(CO)
N$54: C10.1 R27.1 U7.13(VC)
N$55: C9.1 R27.2 U7.14(VB)
N$56: C9.2 G89.T R28.2
N$57: C11.1 L1.2 R28.1 R29.2
N$58: DA16.2 G28.T R25.2
N$59: DA15.2 G20.T R33.2
N$60: C30.1 G5.T J1.P$1 T1.3
N$61: C30.2 G6.T J1.P$2 T1.1
N$62: C31.2 C59.- DB1.3 G8.T T1.2
N$63: C31.1 DB1.4 G7.T T1.4
N$64: C67.+ DB1.1(+) F1.P$2 G9.T
N$65: C32.2 F1.P$1 G4.T P3.1
N$66: C33.2 C34.2 C63.+ DA11.1 G3.T P3.2 Q18.3 R76.1 U12.I(VI) VA1.1
N$67: C59.+ DA11.3 G23.T
N$68: C60.+ DA11.2 R72.1
N$69: C64.+ G226.T Q18.1 R76.2
N$70: U13.16(CPUK) U14.48(CPUK)
N$71: U13.15(PD2) U14.49(PD2)
N$72: U13.14(PD3) U14.50(PD3)
N$73: U13.52(CPUA15) U14.76(A15)
N$74: U13.53(CPUA14) U14.75(A14)
N$75: U13.54(CPUA13) U14.74(A13)
N$76: U13.55(CPUA12) U14.72(A12)
N$77: U13.56(CPUA11) U14.71(A11)
N$78: U13.59(CPUA10) U14.70(A10)
N$79: U13.60(CPUA9) U14.69(A9)
N$80: U13.61(CPUA8) U14.68(A8)
N$81: U13.62(CPUA7) U14.67(A7)
N$82: U13.63(CPUA6) U14.66(A6)
N$83: U13.64(CPUA5) U14.65(A5)
N$84: G183.T U13.1(CPUA4) U14.64(A4)
N$85: G182.T U13.2(CPUA3) U14.63(A3)
N$86: G181.T U13.3(CPUA2) U14.62(A2)
N$87: G180.T U13.4(CPUA1) U14.61(A1)
N$88: G179.T U13.5(CPUA0) U14.60(A0)
N$89: G178.T U13.6(CPUD7) U14.59(D7)
N$90: G177.T U13.7(CPUD6) U14.58(D6)
N$91: U13.8(CPUD5) U14.57(D5)
N$92: G176.T U13.9(CPUD4) U14.56(D4)
N$93: G175.T U13.10(CPUD3) U14.55(D3)
N$94: U13.11(CPUD2) U14.54(D2)
N$95: U13.12(CPUD1) U14.53(D1)
N$96: U13.13(CPUD0) U14.51(D0)
N$97: G131.T U14.45(XTALO) X2.P$2
N$98: G130.T U14.46(XTALI) X2.P$1
N$99: C73.+ G167.T U17.9(RREF) U17.10(LREF)
N$100: G174.T U14.43(LRCK) U17.13(LRCK)
N$101: U14.44(DATA) U17.15(SI)
N$102: G173.T U14.42(BCK) U17.16(CLK)
N$103: G31.T R99.1 U17.6(ROUT)
N$104: C74.2 G29.T R99.2 R101.1
N$105: C75.1 G30.T R101.2 R102.1
N$106: C76.2 G47.T R102.2 U10.12(D:+IN)
N$107: G42.T Q13.1 R48.2
N$108: C77.2 G46.T R103.2 R104.1
N$109: C78.1 G48.T R104.2 R105.1
N$110: C79.2 G49.T R105.2 U10.10(C:+IN)
N$111: C23.2 G44.T R53.1
N$112: G166.T R103.1 U17.11(LOUT)
N$113: C24.2 G51.T R54.1
N$114: C25.2 G50.T R55.1
N$115: G36.T Q14.2 R53.2 R54.2 R55.2 R56.1 U10.6(B:-IN)
N$116: G39.T Q16.2 R58.1 R66.1 R67.1 R68.1
N$117: C53.2 G38.T Q14.1 R52.2
N$118: G37.T Q14.3 Q16.1 R56.2 R57.1 U10.7(B:OUT)
N$119: C26.2 G53.T R60.1
N$120: C27.2 G33.T R61.1
N$121: C28.2 G34.T R62.1
N$122: Q15.2 R60.2 R61.2 R62.2 R63.1 U10.2(A:-IN)
N$123: G25.T Q15.3 Q17.1 R63.2 R64.1 U10.1(A:OUT)
N$124: G32.T Q17.2 R65.1 R69.1 R70.1 R71.1
N$125: C54.2 G35.T Q15.1 R59.2
N$126: G154.T U8.12
N$127: G155.T U8.13
N$128: G156.T U8.14(NC)
N$129: G157.T U8.15(P20)
N$130: G158.T U8.16(P21)
N$131: G159.T U8.17(P22)
N$132: C3.2 G128.T R3.2
N$133: G161.T U8.6(CL2)
N$134: G162.T U8.5(NC)
N$135: U14.38(TK)
N$148: G194.T U14.21(DIP)
N$149: U14.37(TF)
N$150: U14.40(MCK)
N$151: U14.41(SCLK)
N$152: U14.77(XCK)
N$153: U14.79(CK1)
N$154: U14.80(CK2)
N$155: U14.1(DKD)
N$156: G184.T U14.2(MXK)
N$157: U14.3(MX1)
N$158: G185.T U14.4(MX2)
N$159: U14.5(MX3)
N$160: G200.T U17.5(AGND)
N$161: G201.T U13.35(T1)
N$162: G202.T U13.36(T0)
N$163: G203.T U13.34(P40)
N$164: G204.T U13.33(P41)
N$165: G205.T U13.32(P42)
N$166: G206.T U13.31(P43)
N$167: G207.T U13.30(P44)
N$168: G208.T U13.29(P45)
N$169: G209.T U13.28(P46)
N$170: G210.T U13.27(P47)
N$171: G211.T U13.25(P50)
N$172: G212.T U13.24(P51)
N$173: G213.T U13.23(P52)
N$174: G214.T U13.22(P53)
N$175: G215.T U13.21(P54)
N$176: G216.T U13.20(P55)
N$177: G217.T U13.19(P56)
N$178: G218.T U13.18(P57)
N$179: G219.T U13.17(!P5RD)
N$180: U7.18(PDO)
N$181: U7.15(VA)
N$182: U7.17(PHA)
N$183: G227.T U6.9(NC)
N$184: G228.T U6.18(NC)
N$185: U6.19(NC)
N$186: G229.T U6.20(NC)
N$187: U6.21(NC)
N$188: U6.22(NC)
N$189: G230.T U6.55(G)
N$190: G231.T U1.80(R/!W)
N$191: G237.T U1.88(ALCK)
N$192: G238.T U1.89(!VP)
N$193: G236.T U1.87(VDA)
N$194: G235.T U1.86(VPA)
N$195: G234.T U1.84(XF)
N$196: G233.T U1.83(MF)
N$197: G232.T U1.82(!ML)
N$198: G240.T U1.19(JPIO0)
N$199: G239.T U1.20(JPIO1)
N$200: U1.21(JPIO2)
N$201: U1.22(JPIO3)
N$202: U1.23(JPIO4)
N$203: U1.24(JPIO5)
N$204: G241.T U1.39(JPOUT2)
N$205: G242.T U1.38(JPOUT1)
N$206: G244.T U1.71(CPUCK)
N$207: G243.T U1.70(!DMA)
N$208: G296.T U2.46(VA15)
PA0: G66.T P1.28(PA0) P5.1(PA0) U1.51(PA0) U2.12(PA0) U3.24(PA0) U6.53(PA0) U13.49(A0)
PA1: G76.T P1.59(PA1) P5.2(PA1) U1.52(PA1) U2.11(PA1) U3.23(PA1) U6.54(PA1) U13.48(A1)
PA2: G65.T P1.29(PA2) P5.3(PA2) U1.53(PA2) U2.10(PA2) U3.22(PA2) U6.43(!PS1)
PA3: G75.T P1.60(PA3) P5.4(PA3) U1.54(PA3) U2.9(PA3) U3.21(PA3) U6.44(!PS2)
PA4: G64.T P1.30(PA4) P5.5(PA4) U1.55(PA4) U2.8(PA4) U3.20(PA4) U6.45(!PS3)
PA5: G77.T P1.61(PA5) P5.6(PA5) U1.56(PA5) U2.7(PA5) U3.19(PA5) U6.46(!PS4)
PA6: G63.T P1.3(PA6) P5.7(PA6) U1.57(PA6) U2.6(PA6) U3.18(PA6) U6.47(!PS5) U13.50(CS)
PA7: G78.T P1.34(PA7) P5.8(PA7) U1.58(PA7) U2.5(PA7) U3.17(PA7) U6.50(PS1) U13.51(!CS)
PRIO0: G269.T U2.87(PRIO0) U3.44(PRIO0)
PRIO1: G268.T U2.86(PRIO1) U3.45(PRIO1)
R: Q3.1 U3.95(R)
R': G95.T Q4.2 R4.1 R7.1
R_AUDIO: C52.2 C65.- G13.T P4.12(AUDIO-R)
RED: C44.2 DA12.3 DA20.2 G12.T P4.1(RED)
REFRESH: G221.T P1.33(REFRESH) U1.40(REFRESH) U6.7(REFRESH)
RF_AUDIO_OUT: C22.1 G26.T J2.3(AUDIO) R68.2 R71.2
RF_VIDEO_OUT: G54.T J2.2(VIDEO) R30.2 R111.1 U7.7(VO)
SYSCK: P1.57(SYSCK) U1.72(SYSCK) U6.6(SYSCK)
VA14: G295.T U2.47(VA14) U4.1(A14) U5.1(A14)
VAA0: G286.T U2.76(VAA0) U5.10(A0)
VAA1: G287.T U2.75(VAA1) U5.9(A1)
VAA2: G288.T U2.74(VAA2) U5.8(A2)
VAA3: G289.T U2.73(VAA3) U5.7(A3)
VAA4: G290.T U2.72(VAA4) U5.6(A4)
VAA5: G291.T U2.71(VAA5) U5.5(A5)
VAA6: G292.T U2.70(VAA6) U5.4(A6)
VAA7: G293.T U2.69(VAA7) U5.3(A7)
VAA8: G308.T U2.68(VAA8) U5.25(A8)
VAA9: G309.T U2.67(VAA9) U5.24(A9)
VAA10: G307.T U2.66(VAA10) U5.21(A10)
VAA11: G306.T U2.65(VAA11) U5.23(A11)
VAA12: G294.T U2.64(VAA12) U5.2(A12)
VAA13: G310.T U2.63(VAA13) U5.26(A13)
VAB0: G305.T U2.61(VAB0) U4.10(A0)
VAB1: G304.T U2.60(VAB1) U4.9(A1)
VAB2: G303.T U2.59(VAB2) U4.8(A2)
VAB3: G302.T U2.58(VAB3) U4.7(A3)
VAB4: G301.T U2.57(VAB4) U4.6(A4)
VAB5: G300.T U2.56(VAB5) U4.5(A5)
VAB6: G299.T U2.55(VAB6) U4.4(A6)
VAB7: G298.T U2.54(VAB7) U4.3(A7)
VAB8: G280.T U2.53(VAB8) U4.25(A8)
VAB9: G281.T U2.52(VAB9) U4.24(A9)
VAB10: G284.T U2.51(VAB10) U4.21(A10)
VAB11: G282.T U2.50(VAB11) U4.23(A11)
VAB12: G297.T U2.49(VAB12) U4.2(A12)
VAB13: G278.T U2.48(VAB13) U4.26(A13)
VBLANK: G245.T U1.44(VBLANK) U3.26(VBLANK)
VCC: C29.1 C62.+ C81.2 C82.1 C83.1 C84.1 C85.1 C87.2 C88.2 C89.1 C90.1 C91.1 C92.1 C93.1 C94.1 C95.1 C96.1 C97.1 C98.2 C99.2 C100.1 C101.1 C102.2 DA6.3 DA7.3 DA8.3 DA9.3 DA10.3 DA18.3 DA19.3 DA20.3 G1.T G220.T G224.T G225.T J2.1(VCC) P1.27(VCC) P1.58(VCC) P2.1(VCC) P4.10(VCC) P5.20(VCC) Q4.3 Q6.3 Q8.3 Q9.3 Q10.3 Q11.3 Q12.3 R9.2 R11.2 R14.2 R16.2 R19.2 R21.2 R75.2 R77.2 R78.2 R79.2 R80.2 R81.2 R82.2 R92.2 R97.2 R108.1 R109.1 R110.1 RESETSW.1 U1.1(VCC) U1.34(VCC) U1.45(!NMI) U1.59(VCC) U1.76(!ABORT) U1.81(RDY) U1.85(VCC) U2.13(VCC) U2.24(PALMODE) U2.26(!EXTSYNC) U2.36(VCC) U2.62(VCC) U2.81(VCC) U3.5(VCC) U3.30(PALMODE) U3.32(VCC) U3.59(VCC) U3.83(VCC) U3.94(AVCC) U4.28(VCC) U5.28(VCC) U6.1(VCC) U6.10(CS1) U6.11(CS2) U6.12(CS3) U6.16(VCC) U6.32(VCC) U6.49(VCC) U6.51(PS2) U6.52(PS3) U7.4(SW) U7.5(VCC) U8.4(P03) U8.18(VCC) U11.1(VCC) U12.VCC(VO) U13.57(VCC) U14.33(VCC) U14.73(VCC) U15.28(VCC) U16.28(VCC) U17.3(NC) U17.4(DVDD) U17.7(AVDD) U17.8(AVDD) U18.3(VCC) U18.14(_)
VDA0: G262.T U2.37(VDA0) U3.60(VDA0) U5.11(DQ0)
VDA1: G261.T U2.38(VDA1) U3.61(VDA1) U5.12(DQ1)
VDA2: G260.T U2.39(VDA2) U3.62(VDA2) U5.13(DQ2)
VDA3: G259.T U2.40(VDA3) U3.63(VDA3) U5.15(DQ3)
VDA4: G258.T U2.41(VDA4) U3.64(VDA4) U5.16(DQ4)
VDA5: G257.T U2.42(VDA5) U3.65(VDA5) U5.17(DQ5)
VDA6: G256.T U2.43(VDA6) U3.66(VDA6) U5.18(DQ6)
VDA7: G255.T U2.44(VDA7) U3.67(VDA7) U5.19(DQ7)
VDB0: G254.T U2.28(VDB0) U3.51(VDB0) U3.69(EXT0) U4.11(DQ0)
VDB1: G253.T U2.29(VDB1) U3.52(VDB1) U3.70(EXT1) U4.12(DQ1)
VDB2: G252.T U2.30(VDB2) U3.53(VDB2) U3.71(EXT2) U4.13(DQ2)
VDB3: G251.T U2.31(VDB3) U3.54(VDB3) U3.72(EXT3) U4.15(DQ3)
VDB4: G250.T U2.32(VDB4) U3.55(VDB4) U3.73(EXT4) U4.16(DQ4)
VDB5: G249.T U2.33(VDB5) U3.56(VDB5) U3.74(EXT5) U4.17(DQ5)
VDB6: G248.T U2.34(VDB6) U3.57(VDB6) U3.75(EXT6) U4.18(DQ6)
VDB7: G247.T U2.35(VDB7) U3.58(VDB7) U3.76(EXT7) U4.19(DQ7)
VO': Q10.2 R32.1 R33.1
XIN: C5.1 P1.1(MCK) R73.2 U1.48(XIN) U2.100(XIN) U3.31(XIN)
YO': G27.T Q9.2 R24.1 R25.1
Unconnected: DA1.2 U3.2(!PED) U3.3(3.58M) U3.4(!TOUMEI) U3.77(TST0) U3.78(TST1) U3.79(TST2) U3.80(TST3) U3.81(TST4) U3.82(TST5) U3.84(TST6) U3.85(TST7) U3.86(TST8) U3.87(TST9) U3.88(TST10) U3.89(TST11)

## Buses
4017.D0,JPIO7,4016.D1,JPIO6,JPCLK2,4017.D1,JPSTR,4016.D0,JPCLK1
D[0..7]
PA[0..7]
!RAMSEL,!CPUWR,!ROMSEL,!CPURD
CA[0..23]
!PARD,!PAWR
PRIO0,PRIO1,CHR3,CHR1,CHR2,!VCLD,CHR0,COLOR2,COLOR1,COLOR0,!HCLD,FIELD,!OVER,!5MIN
!VRD,!VBWR,!VAWR
VDB0,VDA2,VDB7,VDB6,VDB1,VDB5,VDB4,VDB3,VDB2,VDA7,VDA6,VDA5,VDA4,VDA3,VDA1,VDA0
VA14,VAB6,VAB12,VAB13,VAB8,VAB11,VAB10,VAB9,VAA1,VAB7,VAB5,VAB4,VAB3,VAB2,VAB1,VAB0,VAA2,VAA13,VAA12,VAA11,VAA10,VAA9,VAA8,VAA7,VAA6,VAA5,VAA4,VAA3,VAA0
!SWE,!SCE1,!SOE,!SCE0
MD0,MD4,MD1,MD5,MD2,MD7,MD3,MD6
MA0,MA15,MA1,MA5,MA4,MA2,MA8,MA3,MA6,MA7,MA9,MA10,MA11,MA12,MA13,MA14

## Notes on the sheet
- EXTLATCH | !RESOUT1

## Library data of the parts
C1-C3 C6-C19 C22-C54 C68 C70 C74-C102 = snes_mb:C0805
C4 C5 C69 E1-E3 R4-R6 R24 R32 R42 R45 R47 R108-R111 = snes_mb:EMPTY_0805
C59-C67 C73 = snes_mb:CAPA_POL
D1 = snes_mb:D-ZENER
DA1-DA5 = snes_mb:D_ARRAY_P202
DA6-DA10 DA12-DA20 = snes_mb:D_ARRAY_N202
DA11 = snes_mb:D_ARRAY_N217
DB1 = snes_mb:RECTIFIER
F1 = snes_mb:FUSE
G1-G310 = snes_mb:TEST
J1 = snes_mb:POWER_JACK
J2 = snes_mb:RF_MODULATOR
L1 = snes_mb:INDUCTOR: Inductor 22µH
P1 = snes_mb:CART: 62-pin SNES cart edge with expansion connectors Credits : Quertymodo
P2 = snes_mb:CTRLS_CONNECTOR: Front panel controllers connector
P3 = snes_mb:PWR_SW
P4 = snes_mb:MULTI_OUT
P5 = snes_mb:EXPANSION: Expansion connector for external (EXT) devices (eg. Satellaview)
Q3 Q5 Q7 = snes_mb:PNP-DAR
Q4 Q6 Q8-Q18 = snes_mb:NPN
R1-R3 R7-R23 R25-R31 R33-R41 R43 R44 R46 R48-R99 R101-R107 = snes_mb:R0805
RESETSW = snes_mb:RESET_SW
T1 = snes_mb:TRANSF
TC1 = snes_mb:C-TRIMM: SMD Trimmable Capacitor 20pF
U1 = snes_mb:S-CPU(5A22): 65C816 SNES Main CPU
U2 = snes_mb:S-PPU1(5C77): Picture Processing Unit
U3 = snes_mb:S-PPU2(5C78): Picture Processing Unit
U4 U5 = snes_mb:PPU_SRAM: 32Kx8 SRAM for PPU MS62256CL-10FC
U6 = snes_mb:S-WRAM: Work RAM 128Kx8 DRAM
U7 = snes_mb:S-ENC: Video Encoder
U8 = snes_mb:CIC: CIC (Checking Integrated Circuit) Region Lockout Chip PAL Region F413 NTSC Region F411
U10 = snes_mb:LM324: Quad OP AMP
U11 = snes_mb:PST529: For System Resetting
U12 = snes_mb:7805
U13 = snes_mb:S-SMP: Sony SPC700 Sound Processor
U14 = snes_mb:S-DSP: Sony Sound Chip
U15 U16 = snes_mb:APU_SRAM: 32Kx8 SRAM for APU MCM51L832F12
U17 = snes_mb:UPD6376: 16-bit Stereo DAC
U18 = snes_mb:S-CLK
VA1 = snes_mb:VARISTOR
X1 = snes_mb:XTAL_MAIN: Main Crystal PAL : 17.734 MHz NTSC : 21.47727 MHz
X2 = snes_mb:XTAL_S-DSP

## Net classes
0 default: width 0.254 mm